# EAGLE design Worlds tiniest Arduino (EAGLE 6.3)
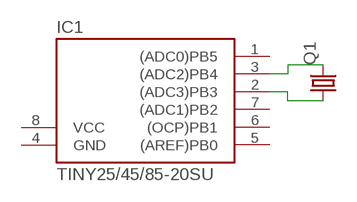
[diagram p0: schematic, sheet 1]

## Parts
IC1  TINY25/45/85-20SU  [SOIC8]
Q1  CRYTALTC26V  [TC26V]

## Nets
N$1: IC1.3((ADC2)PB4) Q1.2
N$2: IC1.2((ADC3)PB3) Q1.1
Unconnected: IC1.1((ADC0)PB5) IC1.5((AREF)PB0) IC1.6((OCP)PB1) IC1.7((ADC1)PB2)

## Power pins joined to a net without a drawn wire
GND: IC1.4(GND)
VCC: IC1.8(VCC)

## Library data of the parts
IC1 = avr-6:TINY25/45/85
Q1 = crystal:CRYTAL: CRYSTAL

## Board
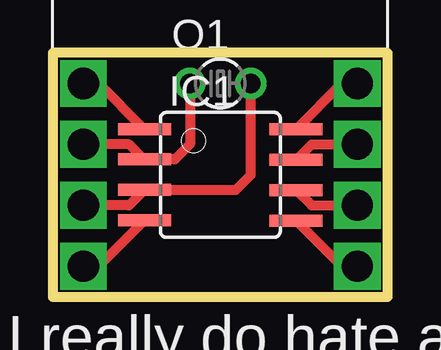
[diagram p1: board, top side]
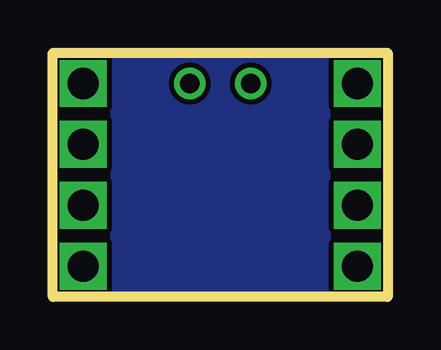
[diagram p2: board, bottom side, seen from below]

No outline drawn. Coordinates in mm, seen from the top.
Copper layers (1*16): Top 0.035mm / dielectric 1.5mm / Bottom 0.035mm
Design rules "default": minimum track width 10mil, minimum drill 24mil, track to track 8mil, track to pad 8mil, pad to pad 8mil, via to via 8mil, smd to smd 8mil, copper to edge 40mil, drill to drill 8mil, minimum pad ring 10mil, minimum via ring 8mil, stop-mask expansion 4mil, vias tented up to drill 0mil, thermal gap 10mil
Milling: 4 lines

### Footprints (pad centres in the part's own frame; a part is rotated, then mirrored left to right if it is on the bottom)
SOIC8 = smd 0.5 x 2.2: 1 -1.905,-3.154; 2 -0.645,-3.154; 3 0.625,-3.154; 4 1.895,-3.154; 5 1.905,3.154; 6 0.635,3.154; 7 -0.635,3.154; 8 -1.905,3.154
TC26V = drill 0.813: 1 -1.27,0; 2 1.27,0

### Placement (x,y rotation side)
IC1  8.89,7.62 270 top
Q1  8.89,11.43 0 top

### Tracks (layer width: path | path; a pad name or v marks a point on that pad's centre or on a via)
N$1
  Top 0.406: IC1.3 9.54,7 10.16,7.62 Q1.2
N$2
  Top 0.406: Q1.1 7.62,8.89 7,8.27 IC1.2
N$3  (via drill 1.3)
  Top 0.406: 5.71,5.71 3.81,3.81 v3.17,3.81
N$4  (via drill 1.3)
  Top 0.406: 5.71,6.99 5.08,6.35 v3.17,6.35
N$5  (via drill 1.3)
  Top 0.406: 5.71,8.26 5.08,8.89 v3.17,8.89
N$6  (via drill 1.3)
  Top 0.406: 5.71,9.53 3.81,11.43 v3.17,11.43
N$7  (via drill 1.3)
  Top 0.406: 12.06,9.53 13.97,11.43 v14.61,11.43
N$8  (via drill 1.3)
  Top 0.406: 12.06,8.26 12.7,8.89 v14.61,8.89
N$9  (via drill 1.3)
  Top 0.406: 12.06,5.71 13.97,3.81 v14.61,3.81
N$10  (via drill 1.3)
  Top 0.406: 12.06,6.99 12.7,6.35 v14.61,6.35
N$11
  pour Bottom: 2.54,12.7 15.88,12.7 15.88,2.54 1.91,2.54 1.91,12.7

### Text on the board
tPlace: I really do hate all of you